# Altium project OpenMVMount.PrjPcb
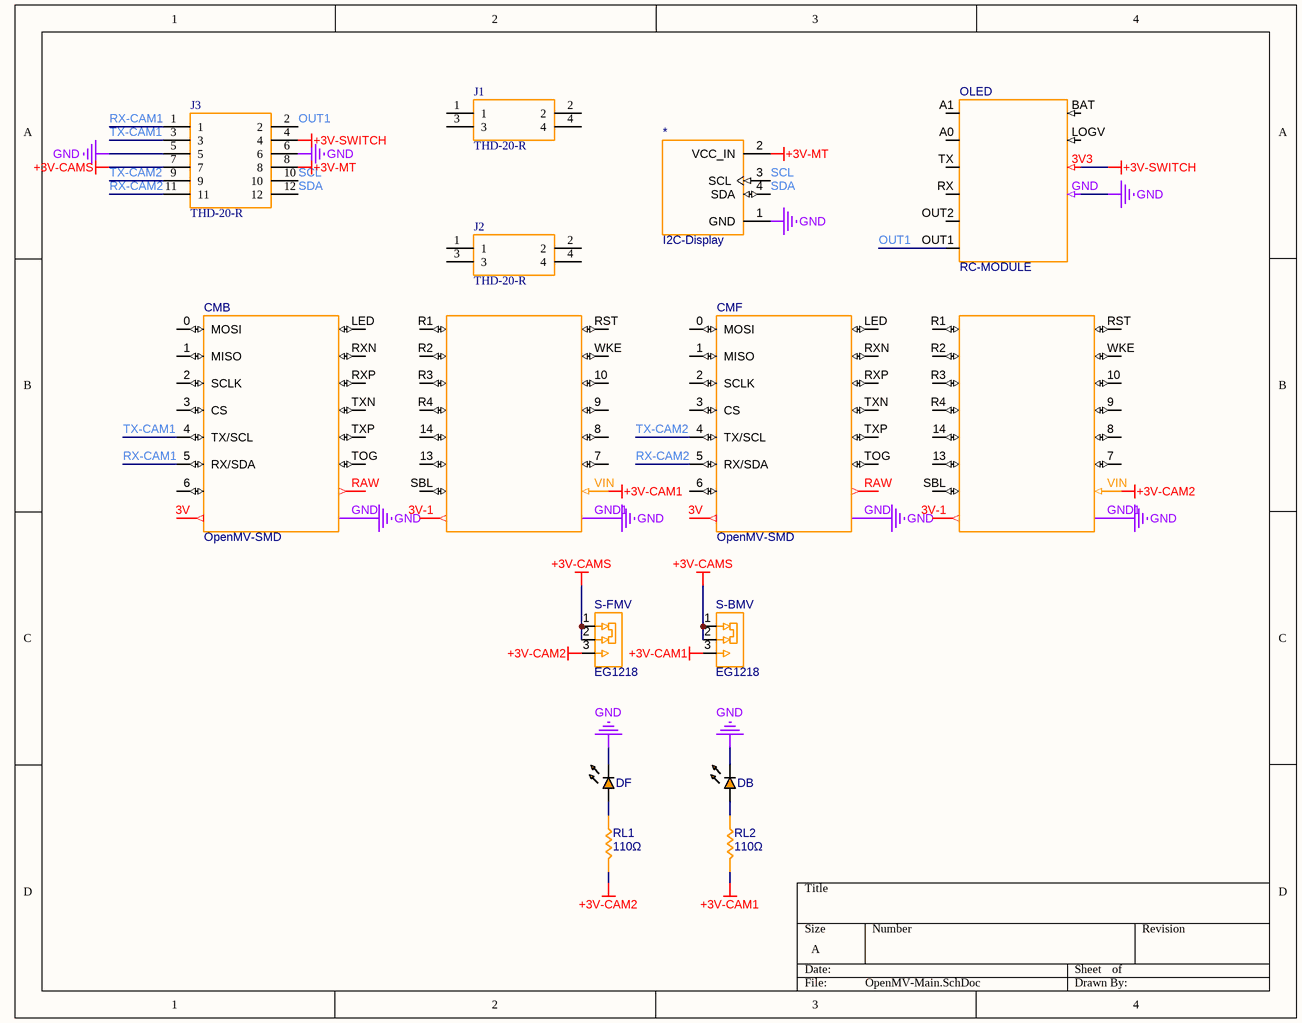
[diagram p0: OpenMV-Main.SchDoc]
1 sheet, 13 parts. Net scope: global (net labels, ports and power ports of the same name join across sheets).
Board file: CAMERA.PcbDoc

## Sheet OpenMV-Main.SchDoc
size A; SheetNumber: 1; SheetTotal: 1

### Parts
*  I2C-Display  [I2C-Display]
CMB  OpenMV-SMD  [OpenMV-SMD]
CMF  OpenMV-SMD  [OpenMV-SMD]
DB  LED_0603  [LED_0603]  (value not drawn)
DF  LED_0603  [LED_0603]  (value not drawn)
J1  THD-20-R  [VALCON_THD-20-R]
J2  THD-20-R  [VALCON_THD-20-R]
J3  THD-20-R  [VALCON_THD-20-R]
OLED  RC-MODULE  [RC-MODULE]
RL1  110Ω  [RES_0603]
RL2  110Ω  [RES_0603]
S-BMV  EG1218  [EG1218]
S-FMV  EG1218  [EG1218]

### Nets
+3V-CAM1: CMB.VIN RL2.1 S-BMV.3(NO)
+3V-CAM2: CMF.VIN RL1.1 S-FMV.3(NO)
+3V-CAMS: J3.7 S-BMV.1(NC) S-BMV.2(COM) S-FMV.1(NC) S-FMV.2(COM)
+3V-MT: *.2(VCC_IN) J3.8
+3V-SWITCH: J3.4 OLED.3V3
GND: *.1(GND) CMB.GND CMB.GND1 CMF.GND CMF.GND1 DB.C DF.C J3.5 J3.6 OLED.GND
OUT1: J3.2 OLED.OUT1
RX-CAM1: CMB.5(RX/SDA) J3.1
RX-CAM2: CMF.5(RX/SDA) J3.11
SCL: *.3(SCL) J3.10
SDA: *.4(SDA) J3.12
TX-CAM1: CMB.4(TX/SCL) J3.3
TX-CAM2: CMF.4(TX/SCL) J3.9
NetDB_A: DB.A RL2.2
NetDF_A: DF.A RL1.2

Not connected (* = marked no-connect by the designer): CMB 0(MOSI) 1(MISO) 2(SCLK) 3(CS) 3V 3V-1 6 7 8 9 10 13 14 LED R1 R2 R3 R4 RAW RST RXN RXP SBL TOG TXN TXP WKE; CMF 0(MOSI) 1(MISO) 2(SCLK) 3(CS) 3V 3V-1 6 7 8 9 10 13 14 LED R1 R2 R3 R4 RAW RST RXN RXP SBL TOG TXN TXP WKE; J1 1 2 3 4; J2 1 2 3 4; OLED A0 A1 BAT LOGV OUT2 RX TX

### Library data of the parts
J1-J3 = THD-20-R: THD - Valcon 2.54mm Pitch Dual Row Pin Header - Fast Stock; SnapEDA_Link: https://www.snapeda.com/parts/THD-20-R/Valcon/view-part/?ref=snap; Package: None; Value: *; MF: Valcon; MP: THD-20-R; Check_prices: https://www.snapeda.com/parts/THD-20-R/Valcon/view-part/?ref=eda
RL1 RL2 = RES_0603: Resistor SMD 0603 generic
S-BMV S-FMV = CMP-011-000013-1: Source: GenericRC.SchLib; Design Item ID: EG1218; Component Type: Standard; Pin Count: 3